# EAGLE design ll3-b4 (EAGLE 5.10)
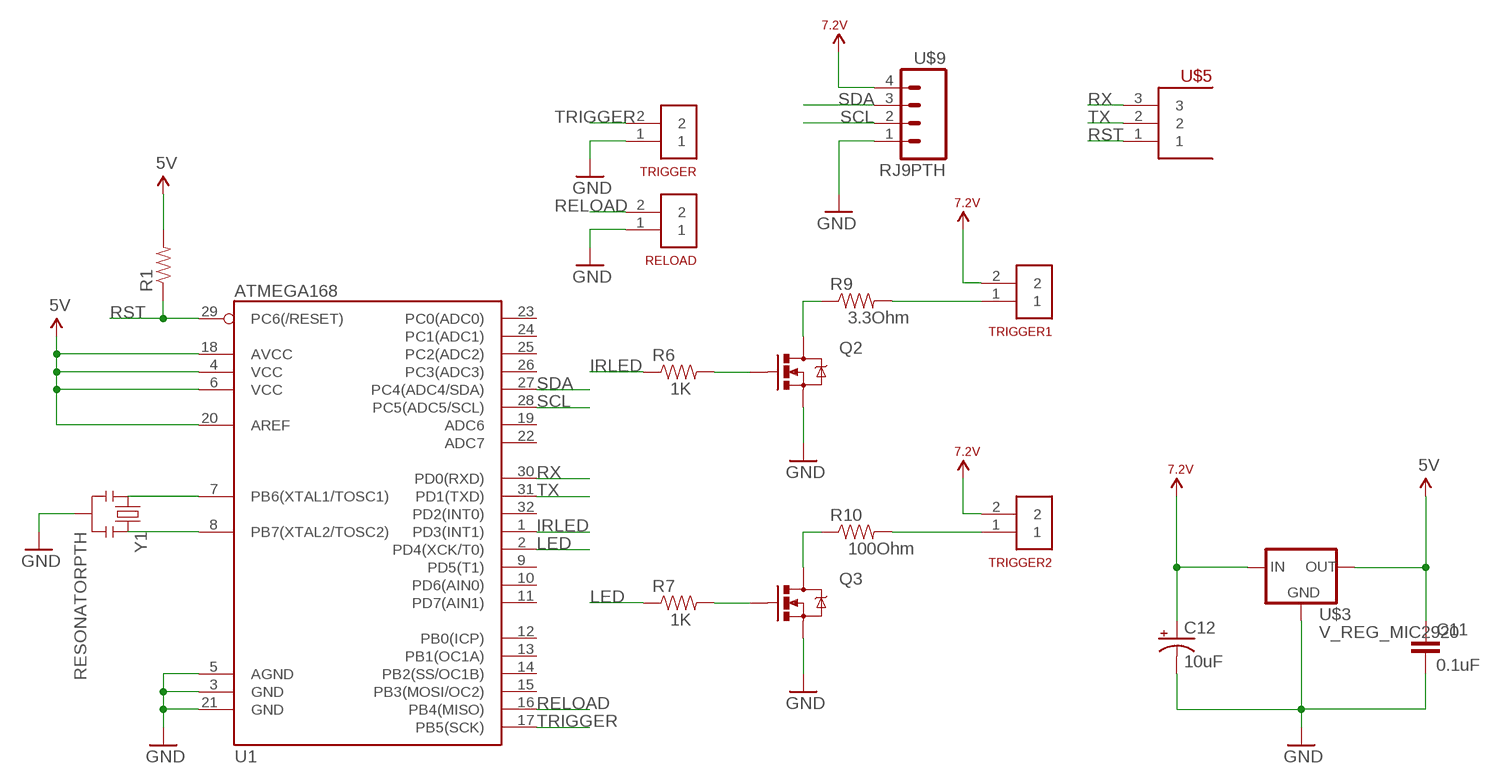
[diagram p0: schematic, sheet 1]

## Parts
C11  0.1uF  CAP0805  [0805]
C12  10uF  CAP_POL1206  [EIA3216]
Q2  MOSFET-NCHANNELSMD  [SOT23-3]
Q3  MOSFET-NCHANNELSMD  [SOT23-3]
R1  RESISTOR  [0805]
R6  1K  RESISTOR  [0805]
R7  1K  RESISTOR  [0805]
R9  3.3Ohm  RESISTORPTH1  [AXIAL-0.3]
R10  100Ohm  RESISTORPTH1  [AXIAL-0.3]
RELOAD  2HEAD  [2HEAD]
TRIGGER  2HEAD  [2HEAD]
TRIGGER1  2HEAD  [2HEAD]
TRIGGER2  2HEAD  [2HEAD]
U1  ATMEGA168  [TQFP32-08]
U$3  V_REG_MIC2920  [SOT223]
U$5  3HEAD  [3HEAD]
U$9  RJ9PTH  [RJ9]
Y1  RESONATORPTH  [RESONATOR-PTH]

## Nets
5V: C11.1 R1.2 U1.4(VCC) U1.6(VCC) U1.18(AVCC) U1.20(AREF) U$3.3(OUT)
7.2V: C12.A(+) TRIGGER1.2 TRIGGER2.2 U$3.1(IN) U$9.4
GND: C11.2 C12.C(-) Q2.2(S) Q3.2(S) RELOAD.1 TRIGGER.1 U1.3(GND) U1.5(AGND) U1.21(GND) U$3.2(GND) U$9.1 Y1.2
IRLED: R6.1 U1.1(PD3(INT1))
LED: R7.1 U1.2(PD4(XCK/T0))
N$1: U1.7(PB6(XTAL1/TOSC1)) Y1.1
N$2: U1.8(PB7(XTAL2/TOSC2)) Y1.3
N$14: Q2.1(G) R6.2
N$15: Q3.1(G) R7.2
N$16: R9.P$2 TRIGGER1.1
N$17: R10.P$2 TRIGGER2.1
N$18: Q3.3(D) R10.P$1
N$20: Q2.3(D) R9.P$1
RELOAD: RELOAD.2 U1.16(PB4(MISO))
RST: R1.1 U1.29(PC6(/RESET)) U$5.1
RX: U1.30(PD0(RXD)) U$5.3
SCL: U1.28(PC5(ADC5/SCL)) U$9.2
SDA: U1.27(PC4(ADC4/SDA)) U$9.3
TRIGGER: TRIGGER.2 U1.17(PB5(SCK))
TX: U1.31(PD1(TXD)) U$5.2
Unconnected: U1.9(PD5(T1)) U1.10(PD6(AIN0)) U1.11(PD7(AIN1)) U1.12(PB0(ICP)) U1.13(PB1(OC1A)) U1.14(PB2(SS/OC1B)) U1.15(PB3(MOSI/OC2)) U1.19(ADC6) U1.22(ADC7) U1.23(PC0(ADC0)) U1.24(PC1(ADC1)) U1.25(PC2(ADC2)) U1.26(PC3(ADC3)) U1.32(PD2(INT0))

## Library data of the parts
C11 = sparkfun:CAP: Capacitor Standard 0603 ceramic capacitor, and 0.1" leaded capacitor.
C12 = sparkfun:CAP_POL: Capacitor Polarized These are standard SMD and PTH capacitors. Normally 10uF, 47uF, and 100uF in electrolytic and tantalum varieties. Always verify the external diameter of the through hole cap, it varies with capacity, voltage, and manufacturer. The EIA devices should be standard.
Q2 Q3 = sparkfun:MOSFET-NCHANNEL
R1 R6 R7 R9 R10 = sparkfun:RESISTOR: Resistor Basic schematic elements and footprints for 0603, 1206, and PTH 1/10th watt (small) resistors.
RELOAD TRIGGER TRIGGER1 TRIGGER2 = custom:2HEAD
U1 = sparkfun:ATMEGA168
U$3 = sparkfun:V_REG_MIC2920: MIC2920A (http://www.micrel.com/_PDF/mic2920.pdf) - 400mA output LDO Regulator
U$5 = custom:3HEAD
U$9 = sparkfun:RJ9
Y1 = sparkfun:RESONATOR: Resonator Small SMD resonator. This is the itty bitty 10/20MHz resonators with built in caps. CSTCE10M0G55 and CSTCE20M0V53. Footprint has been reviewed closely but hasn't been tested yet.

## Board
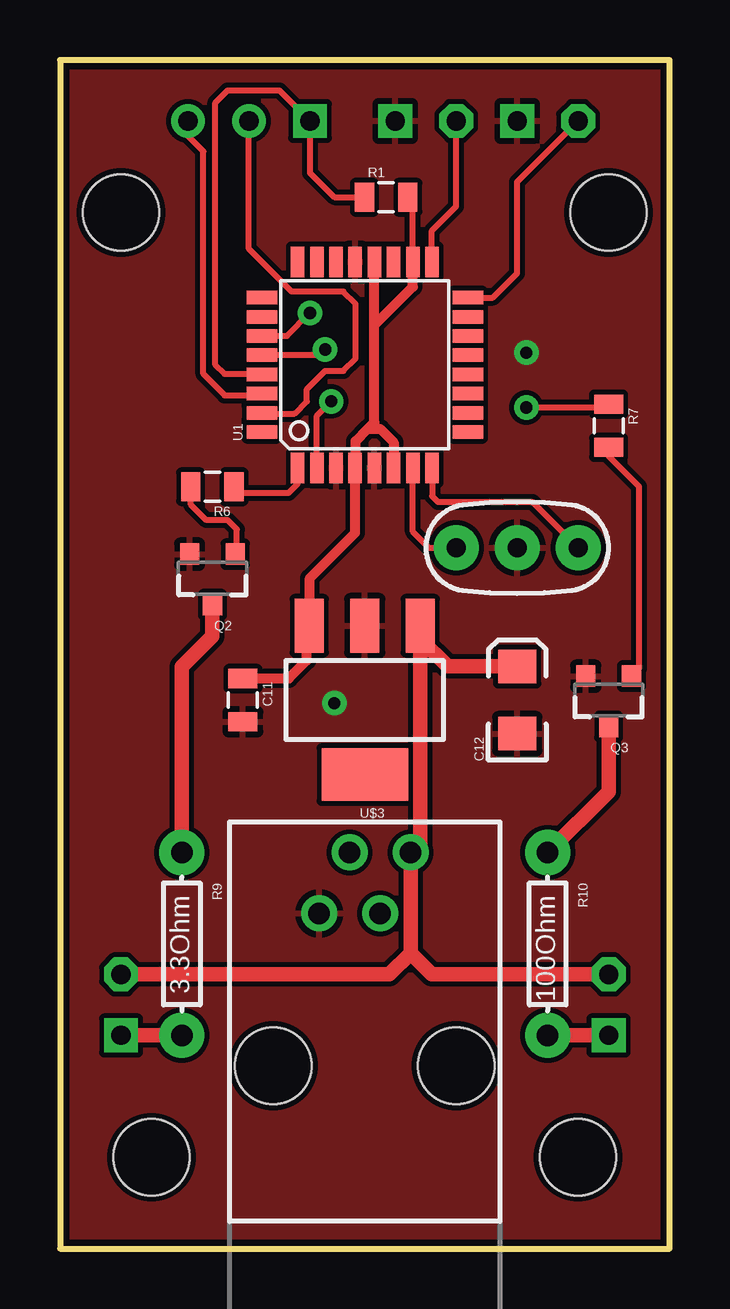
[diagram p1: board, top side]
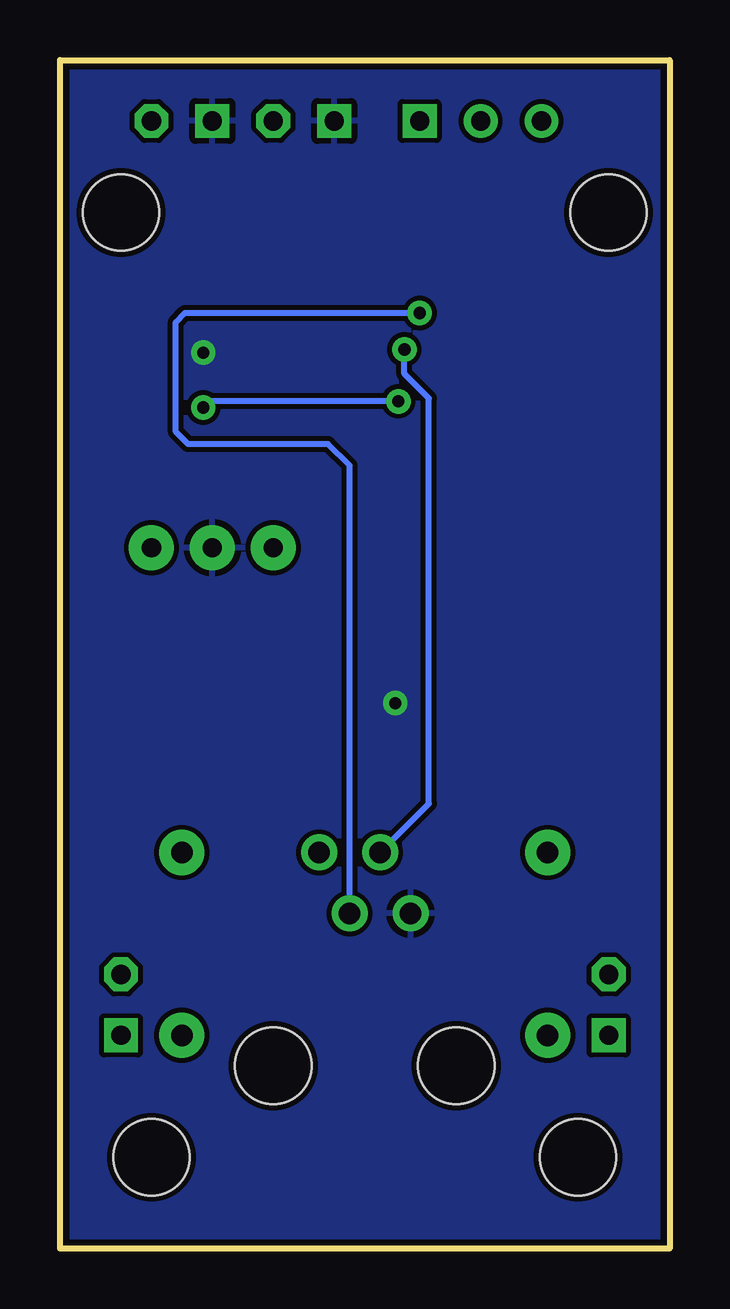
[diagram p2: board, bottom side, seen from below]

Size 25.4 x 49.53 mm. Coordinates in mm from the lower left corner, seen from the top.
Outline: 25.4,49.53 0,49.53 0,0 25.4,0 25.4,49.53
Copper layers (1*16): Top 0.035mm / dielectric 1.5mm / Bottom 0.035mm
Design rules "SparkFun": minimum track width 8mil, minimum drill 20mil, track to track 8mil, track to pad 8mil, pad to pad 8mil, via to via 8mil, smd to smd 8mil, copper to edge 10mil, drill to drill 8mil, minimum pad ring 12mil, minimum via ring 10mil, stop-mask expansion 4mil, vias tented up to drill 25mil, thermal gap 10mil
Holes 3.17 mm at 3.81,3.81 21.59,3.81 22.86,43.18 2.54,43.18

### Footprints (pad centres in the part's own frame; a part is rotated, then mirrored left to right if it is on the bottom)
0805 = smd 0.8 x 1.2: 1 -0.9,0; 2 0.9,0
EIA3216 = smd 1.4 x 1.6: A 1.4,0; C -1.4,0
SOT23-3 = smd 0.8 x 0.9: 1 -0.95,-1; 2 0.95,-1; 3 0,1.1
AXIAL-0.3 = drill 0.9 pad 1.88 round: P$1 -3.81,0; P$2 3.81,0
2HEAD = drill 0.8 square: 1 -1.27,0 | drill 0.8 octagon: 2 1.27,0
TQFP32-08 = smd 1.27 x 0.559: 1 -4.293,2.8; 2 -4.293,2; 3 -4.293,1.2; 4 -4.293,0.4; 5 -4.293,-0.4; 6 -4.293,-1.2; 7 -4.293,-2; 8 -4.293,-2.8; 17 4.293,-2.8; 18 4.293,-2; 19 4.293,-1.2; 20 4.293,-0.4; 21 4.293,0.4; 22 4.293,1.2; 23 4.293,2; 24 4.293,2.8 | smd 0.559 x 1.27: 9 -2.8,-4.293; 10 -2,-4.293; 11 -1.2,-4.293; 12 -0.4,-4.293; 13 0.4,-4.293; 14 1.2,-4.293; 15 2,-4.293; 16 2.8,-4.293; 25 2.8,4.293; 26 2,4.293; 27 1.2,4.293; 28 0.4,4.293; 29 -0.4,4.293; 30 -1.2,4.293; 31 -2,4.293; 32 -2.8,4.293
SOT223 = smd 1.219 x 2.235: 1 -2.311,-3.099; 2 0,-3.099; 3 2.311,-3.099 | smd 3.6 x 2.2: 4 0,3.099
3HEAD = drill 0.8 square: 1 -2.54,0 | drill 0.8 round: 2 0,0; 3 2.54,0
RJ9 = drill 0.889 round: 1 -1.905,6.35; 2 -0.635,8.89; 3 0.635,6.35; 4 1.905,8.89 | hole 3.2: -3.81,0; 3.81,0
RESONATOR-PTH = drill 0.8 pad 1.88 round: 1 -2.54,0; 2 0,0; 3 2.54,0

### Placement (x,y rotation side)
C11  7.62,22.86 270 top
C12  19.05,22.86 90 top
Q2  6.35,27.94 180 top
Q3  22.86,22.86 180 top
R1  13.59,43.81 0 top
R6  6.35,31.75 180 top
R7  22.86,34.29 270 top
R9  5.08,12.7 270 top
R10  20.32,12.7 270 top
RELOAD  20.32,46.99 0 top
TRIGGER  15.24,46.99 0 top
TRIGGER1  2.54,10.16 90 top
TRIGGER2  22.86,10.16 90 top
U1  12.7,36.83 90 top
U$3  12.7,22.86 180 top
U$5  7.87,46.99 180 top
U$9  12.7,7.62 0 top
Y1  19.05,29.21 0 top

### Tracks (layer width: path | path; a pad name or v marks a point on that pad's centre or on a via)
5V
  Top 0.254: U1.18 14.7,43.6 R1.2
  Top 0.406: C11.1 9.54,23.76 10.29,24.51 10.29,25.86 U$3.3 10.41,25.98 10.41,27.94 12.3,29.83 U1.4 12.32,32.56 12.32,33.66 12.83,34.16 | U1.6 13.9,33.6 13.34,34.16 12.83,34.16 | 13.1,38.48 13.1,34.44 12.83,34.16 | 13.1,38.48 U1.20 | U1.18 14.7,40.08 13.1,38.48
7.2V
  Top 0.61: 15.01,25.4 15.01,16.92 U$9.4 14.61,12.32 | 15.01,25.4 U$3.1 | C12.A 16.15,24.26 15.01,25.4 | 14.61,12.32 15.49,11.43 TRIGGER2.2 | 14.61,12.32 13.72,11.43 TRIGGER1.2
GND  (via drill 0.51)
  other vias: 11.43,22.73 19.43,37.34
  pour Bottom: 25.4,49.53 0,49.53 0,0 25.4,0
  pour Top: 0,0 25.4,0 25.4,49.53 0,49.53
IRLED
  Top 0.254: U1.1 9.9,31.87 9.53,31.5 7.5,31.5 R6.1
LED  (via drill 0.51)
  Top 0.254: U1.2 10.7,34.7 v11.3,35.31 | v19.43,35.05 22.72,35.05 R7.1
  Bottom 0.254: v11.3,35.31 19.18,35.31 v19.43,35.05
N$1
  Top 0.254: U1.7 14.7,29.88 15.37,29.21 Y1.1
N$2
  Top 0.254: U1.8 15.5,31.36 15.75,31.11 19.68,31.11 Y1.3
N$14
  Top 0.254: R6.2 5.45,31 6.1,30.35 6.99,30.35 7.37,29.97 7.37,29.01 Q2.1
N$15
  Top 0.254: R7.2 22.86,33.02 24.13,31.75 24.13,24.18 Q3.1
N$16
  Top 0.61: TRIGGER1.1 R9.P$2
N$17
  Top 0.61: R10.P$2 TRIGGER2.1
N$18
  Top 0.61: Q3.3 22.86,19.05 R10.P$1
N$20
  Top 0.61: Q2.3 6.35,25.53 5.08,24.26 R9.P$1
RELOAD
  Top 0.254: U1.16 18.04,39.63 19.05,40.64 19.05,44.45 RELOAD.2
RST
  Top 0.254: R1.1 11.43,43.81 10.41,44.83 U$5.1 9.14,48.26 6.99,48.26 6.48,47.75 6.48,36.83 6.86,36.45 8.39,36.45 U1.29
RX
  Top 0.254: 8.35,35.69 U1.30 8.34,35.56 6.86,35.56 5.97,36.45 5.97,45.72 5.33,46.35 U$5.3
SCL  (via drill 0.51)
  Top 0.254: U1.28 10.81,37.23 v11.05,37.47
  Bottom 0.254: v11.05,37.47 11.05,36.45 10.03,35.43 10.03,18.54 U$9.2
SDA  (via drill 0.51)
  Top 0.254: U1.27 9.46,38.03 v10.41,38.99
  Bottom 0.254: v10.41,38.99 20.19,38.99 20.57,38.61 20.57,34.04 20.07,33.53 14.22,33.53 13.34,32.64 U$9.3
TRIGGER
  Top 0.254: TRIGGER.2 16.51,43.43 15.49,42.42 U1.17
TX
  Top 0.254: U$5.2 7.87,41.66 9.65,39.88 11.81,39.88 12.32,39.37 12.32,37.08 11.81,36.58 11.05,36.58 10.29,35.81 10.29,35.31 9.78,34.8 8.44,34.8 U1.31